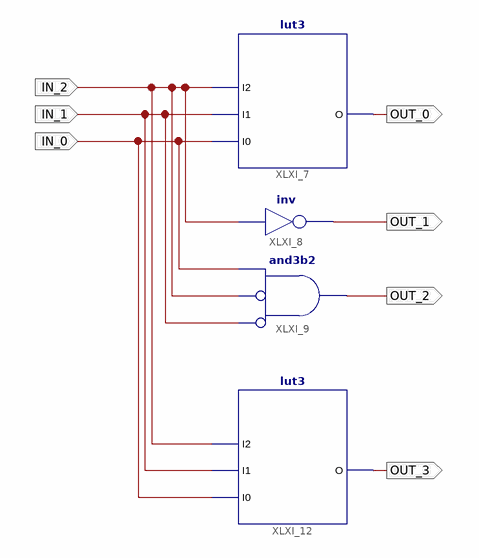
[diagram p0: schematic sheet 1]
// Xilinx ISE schematic Decoder3To4.sch (spartan3a) as structural Verilog: 4 symbols, 7 ports
module Decoder3To4 (
  input  IN_2,
  input  IN_1,
  input  IN_0,
  output OUT_0,
  output OUT_1,
  output OUT_2,
  output OUT_3
);

  lut3 #(.INIT("23")) XLXI_7 (.I0(IN_0), .I1(IN_1), .I2(IN_2), .O(OUT_0));
  not XLXI_8 (OUT_1, IN_2);
  and XLXI_9 (OUT_2, ~IN_1, ~IN_2, IN_0);  // and3b2
  lut3 #(.INIT("24")) XLXI_12 (.I0(IN_0), .I1(IN_1), .I2(IN_2), .O(OUT_3));
endmodule
